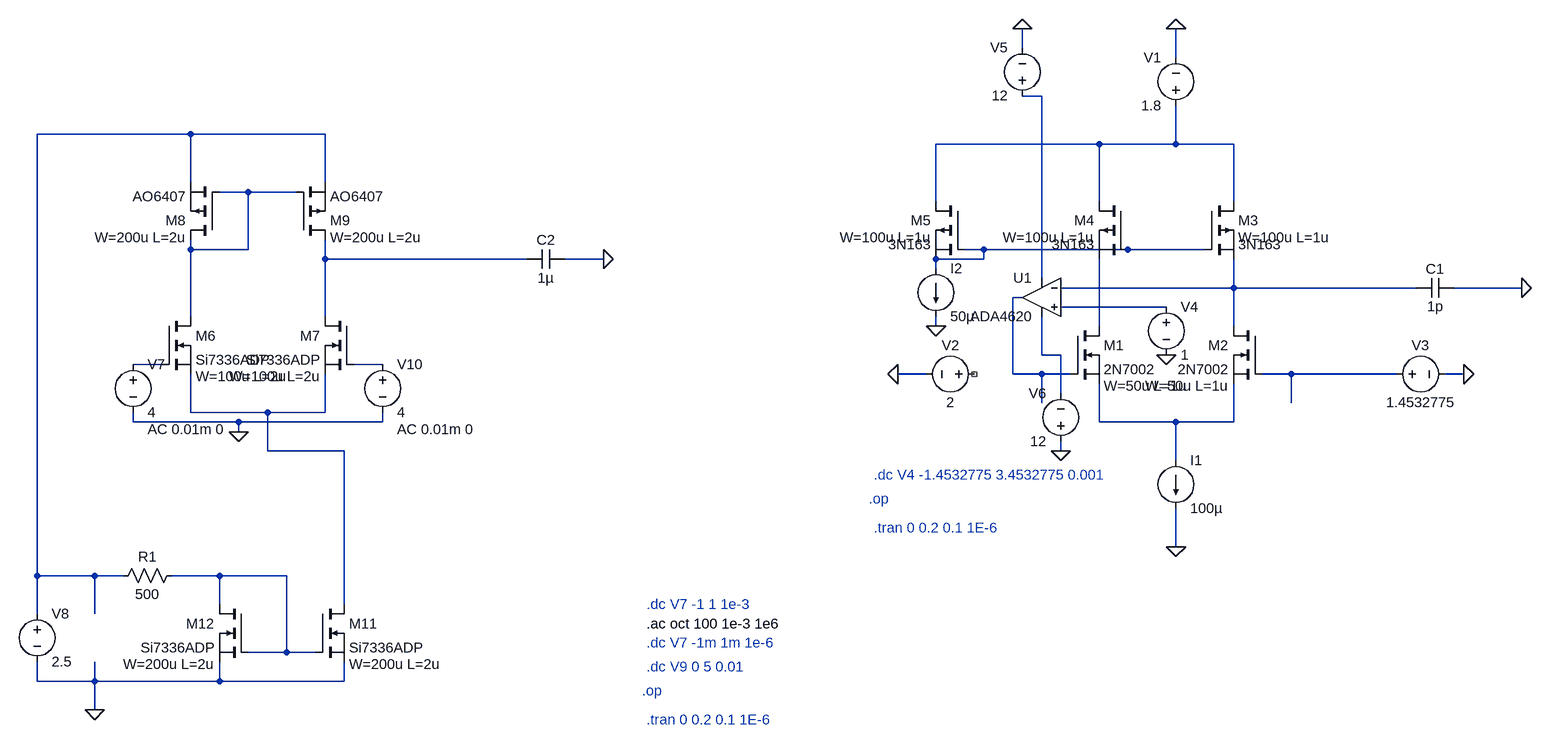
[diagram p0: schematic Draft4.asc]
Draft4.asc, the LTspice schematic file:
Version 4.1
SHEET 1 880 752
WIRE -64 -384 -64 -416
WIRE 192 -368 192 -416
WIRE -32 -304 -64 -304
WIRE -3024 -240 -3280 -240
WIRE -2800 -240 -3024 -240
WIRE 64 -224 -208 -224
WIRE 192 -224 192 -288
WIRE 192 -224 64 -224
WIRE 288 -224 192 -224
WIRE -3024 -160 -3024 -240
WIRE -2800 -160 -2800 -240
WIRE -2928 -144 -2976 -144
WIRE -2848 -144 -2928 -144
WIRE -208 -128 -208 -224
WIRE 64 -128 64 -224
WIRE 288 -128 288 -224
WIRE -3024 -48 -3024 -64
WIRE -2928 -48 -2928 -144
WIRE -2928 -48 -3024 -48
WIRE -128 -48 -160 -48
WIRE 112 -48 -128 -48
WIRE 240 -48 112 -48
WIRE -2800 -32 -2800 -64
WIRE -2464 -32 -2800 -32
WIRE -2336 -32 -2400 -32
WIRE -128 -32 -128 -48
WIRE -128 -32 -208 -32
WIRE -208 -16 -208 -32
WIRE -32 0 -32 -304
WIRE 288 16 288 -32
WIRE 288 16 0 16
WIRE 592 16 288 16
WIRE 768 16 656 16
WIRE -64 32 -80 32
WIRE 176 48 0 48
WIRE -3024 64 -3024 -48
WIRE -2800 64 -2800 -32
WIRE -208 80 -208 64
WIRE 64 80 64 -32
WIRE 288 80 288 16
WIRE -32 128 -32 64
WIRE 0 128 -32 128
WIRE -3072 144 -3120 144
WIRE -2704 144 -2752 144
WIRE -224 160 -272 160
WIRE -80 160 -80 32
WIRE -32 160 -80 160
WIRE 16 160 -32 160
WIRE 384 160 336 160
WIRE 560 160 384 160
WIRE 672 160 640 160
WIRE 0 192 0 128
WIRE -32 208 -32 160
WIRE 384 208 384 160
WIRE -3024 224 -3024 160
WIRE -2896 224 -3024 224
WIRE -2800 224 -2800 160
WIRE -2800 224 -2896 224
WIRE -3120 240 -3120 224
WIRE -2944 240 -3120 240
WIRE -2704 240 -2704 224
WIRE -2704 240 -2944 240
WIRE 64 240 64 176
WIRE 192 240 64 240
WIRE 288 240 288 176
WIRE 288 240 192 240
WIRE -2944 256 -2944 240
WIRE -2896 288 -2896 224
WIRE -2768 288 -2896 288
WIRE 0 288 0 272
WIRE 192 304 192 240
WIRE 192 448 192 384
WIRE -3280 496 -3280 -240
WIRE -3184 496 -3280 496
WIRE -3136 496 -3184 496
WIRE -2976 496 -3056 496
WIRE -2864 496 -2976 496
WIRE -2976 544 -2976 496
WIRE -2768 544 -2768 288
WIRE -3280 560 -3280 496
WIRE -3184 560 -3184 496
WIRE -2864 624 -2864 496
WIRE -2864 624 -2928 624
WIRE -2816 624 -2864 624
WIRE -3280 672 -3280 640
WIRE -3184 672 -3184 640
WIRE -3184 672 -3280 672
WIRE -2976 672 -2976 640
WIRE -2976 672 -3184 672
WIRE -2768 672 -2768 640
WIRE -2768 672 -2976 672
WIRE -3184 720 -3184 672
FLAG 192 448 0
FLAG 768 16 0
FLAG -272 160 0
FLAG 672 160 0
FLAG 192 -416 0
FLAG -208 80 0
FLAG 176 128 0
FLAG -64 -416 0
FLAG 0 288 0
FLAG -3184 720 0
FLAG -2336 -32 0
FLAG -2944 256 0
SYMBOL voltage 192 -272 R180
WINDOW 0 24 96 Left 2
WINDOW 3 24 16 Left 2
WINDOW 123 0 0 Left 0
WINDOW 39 0 0 Left 0
SYMATTR InstName V1
SYMATTR Value 1.8
SYMBOL current 192 304 R0
WINDOW 123 0 0 Left 0
WINDOW 39 0 0 Left 0
SYMATTR InstName I1
SYMATTR Value 100µ
SYMBOL nmos 16 80 R0
WINDOW 123 56 100 Left 2
SYMATTR Value2 W=50u L=1u
SYMATTR InstName M1
SYMATTR Value 2N7002
SYMBOL nmos 336 80 M0
WINDOW 123 56 100 Left 2
SYMATTR Value2 W=50u L=1u
SYMATTR InstName M2
SYMATTR Value 2N7002
SYMBOL pmos 240 -128 R0
WINDOW 123 56 60 Left 2
SYMATTR Value2 W=100u L=1u
SYMATTR InstName M3
SYMATTR Value 3N163
SYMBOL pmos 112 -128 M0
WINDOW 123 56 60 Left 2
SYMATTR Value2 W=100u L=1u
SYMATTR InstName M4
SYMATTR Value 3N163
SYMBOL cap 656 0 R90
WINDOW 0 0 32 VBottom 2
WINDOW 3 32 32 VTop 2
SYMATTR InstName C1
SYMATTR Value 1p
SYMBOL voltage -128 160 R90
WINDOW 0 -32 56 VBottom 2
WINDOW 3 32 56 VTop 2
SYMATTR InstName V2
SYMATTR Value 2
SYMBOL voltage 544 160 R270
WINDOW 0 32 56 VTop 2
WINDOW 3 -32 56 VBottom 2
SYMATTR InstName V3
SYMATTR Value 1.4532775
SYMBOL pmos -160 -128 M0
WINDOW 123 56 60 Left 2
SYMATTR Value2 W=100u L=1u
SYMATTR InstName M5
SYMATTR Value 3N163
SYMBOL current -208 -16 R0
WINDOW 123 0 0 Left 0
WINDOW 39 0 0 Left 0
SYMATTR InstName I2
SYMATTR Value 50µ
SYMBOL voltage 176 32 R0
SYMATTR InstName V4
SYMATTR Value 1
SYMBOL voltage -64 -288 R180
WINDOW 0 24 96 Left 2
WINDOW 3 24 16 Left 2
SYMATTR InstName V5
SYMATTR Value 12
SYMBOL voltage 0 288 R180
WINDOW 0 24 96 Left 2
WINDOW 3 24 16 Left 2
SYMATTR InstName V6
SYMATTR Value 12
SYMBOL OpAmps\\ADA4620 -32 -32 M0
SYMATTR InstName U1
SYMBOL nmos -2816 544 R0
WINDOW 39 56 100 Left 2
SYMATTR SpiceLine W=200u L=2u
SYMATTR InstName M11
SYMATTR Value Si7336ADP
SYMBOL nmos -2928 544 M0
WINDOW 39 56 100 Left 2
SYMATTR SpiceLine W=200u L=2u
SYMATTR InstName M12
SYMATTR Value Si7336ADP
SYMBOL nmos -3072 64 R0
WINDOW 39 56 100 Left 2
SYMATTR SpiceLine W=100u L=2u
SYMATTR InstName M6
SYMATTR Value Si7336ADP
SYMBOL nmos -2752 64 M0
WINDOW 39 56 100 Left 2
SYMATTR SpiceLine W=100u L=2u
SYMATTR InstName M7
SYMATTR Value Si7336ADP
SYMBOL pmos -2976 -64 R180
WINDOW 39 56 4 Left 2
SYMATTR SpiceLine W=200u L=2u
SYMATTR InstName M8
SYMATTR Value AO6407
SYMBOL pmos -2848 -64 M180
WINDOW 39 56 4 Left 2
SYMATTR SpiceLine W=200u L=2u
SYMATTR InstName M9
SYMATTR Value AO6407
SYMBOL cap -2400 -48 R90
WINDOW 0 0 32 VBottom 2
WINDOW 3 32 32 VTop 2
SYMATTR InstName C2
SYMATTR Value 1µ
SYMBOL voltage -3280 544 R0
WINDOW 123 0 0 Left 0
WINDOW 39 0 0 Left 0
SYMATTR InstName V8
SYMATTR Value 2.5
SYMBOL res -3040 480 R90
WINDOW 0 0 56 VBottom 2
WINDOW 3 32 56 VTop 2
SYMATTR InstName R1
SYMATTR Value 500
SYMBOL voltage -3120 128 R0
WINDOW 123 24 124 Left 2
WINDOW 39 0 0 Left 0
SYMATTR InstName V7
SYMATTR Value 4
SYMATTR Value2 AC 0.01m 0
SYMBOL voltage -2704 128 R0
WINDOW 123 24 124 Left 2
WINDOW 39 0 0 Left 0
SYMATTR InstName V10
SYMATTR Value 4
SYMATTR Value2 AC 0.01m 0
TEXT -320 368 Left 2 ;.op
TEXT -312 416 Left 2 ;.tran 0 0.2 0.1 1E-6
TEXT -312 328 Left 2 ;.dc V4 -1.4532775 3.4532775 0.001
TEXT -2272 688 Left 2 ;.op
TEXT -2264 736 Left 2 ;.tran 0 0.2 0.1 1E-6
TEXT -2264 648 Left 2 ;.dc V9 0 5 0.01
TEXT -2264 608 Left 2 ;.dc V7 -1m 1m 1e-6
TEXT -2264 576 Left 2 !.ac oct 100 1e-3 1e6
TEXT -2264 544 Left 2 ;.dc V7 -1 1 1e-3

The netlist it stands for:
* Draft4.asc
V1 N003 0 1.8
I1 N016 0 100µ
M1 N010 N008 N016 N016 2N7002 W=50u L=1u
M2 N007 N014 N016 N016 2N7002 W=50u L=1u
M3 N003 N005 N007 N007 3N163 W=100u L=1u
M4 N003 N005 N010 N010 3N163 W=100u L=1u
C1 0 N007 1p
V2 NC_01 0 2
V3 N014 0 1.4532775
M5 N003 N005 N005 N005 3N163 W=100u L=1u
I2 N005 0 50µ
V4 N009 0 1
V5 N001 0 12
V6 0 N011 12
X§U1 N009 N007 N001 N011 N008 ADA4620  ; pins In+ In- V+ V- OUT
M11 N015 N017 0 0 Si7336ADP W=200u L=2u
M12 N017 N017 0 0 Si7336ADP W=200u L=2u
M6 N004 N012 N015 N015 Si7336ADP W=100u L=2u
M7 N006 N013 N015 N015 Si7336ADP W=100u L=2u
M8 N004 N004 N002 N002 AO6407 W=200u L=2u
M9 N006 N004 N002 N002 AO6407 W=200u L=2u
C2 0 N006 1µ
V8 N002 0 2.5
R1 N017 N002 500
V7 N012 0 4 AC 0.01m 0
V10 N013 0 4 AC 0.01m 0
.model NMOS NMOS
.model PMOS PMOS
.lib standard.mos
* .op
* .tran 0 0.2 0.1 1E-6
* .dc V4 -1.4532775 3.4532775 0.001
* .op
* .tran 0 0.2 0.1 1E-6
* .dc V9 0 5 0.01
* .dc V7 -1m 1m 1e-6
.ac oct 100 1e-3 1e6
* .dc V7 -1 1 1e-3
.backanno
.end